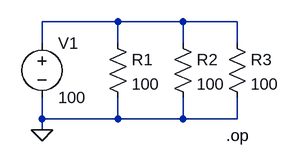
[diagram p0: schematic Lecture1_Ex2.asc]
Lecture1_Ex2.asc, the LTspice schematic file:
Version 4
SHEET 1 880 680
WIRE 192 96 80 96
WIRE 288 96 192 96
WIRE 368 96 288 96
WIRE 80 128 80 96
WIRE 192 128 192 96
WIRE 288 128 288 96
WIRE 368 128 368 96
WIRE 80 240 80 208
WIRE 192 240 192 208
WIRE 192 240 80 240
WIRE 288 240 288 208
WIRE 288 240 192 240
WIRE 368 240 368 208
WIRE 368 240 288 240
WIRE 80 256 80 240
FLAG 80 256 0
SYMBOL voltage 80 112 R0
WINDOW 123 0 0 Left 0
WINDOW 39 0 0 Left 0
SYMATTR InstName V1
SYMATTR Value 100
SYMBOL res 176 112 R0
SYMATTR InstName R1
SYMATTR Value 100
SYMBOL res 272 112 R0
SYMATTR InstName R2
SYMATTR Value 100
SYMBOL res 352 112 R0
SYMATTR InstName R3
SYMATTR Value 100
TEXT 352 264 Left 2 !.op

The netlist it stands for:
* Lecture1_Ex2.asc
V1 N001 0 100
R1 N001 0 100
R2 N001 0 100
R3 N001 0 100
.op
.backanno
.end